# Altium project MBT03_IB_V2.PrjPcb
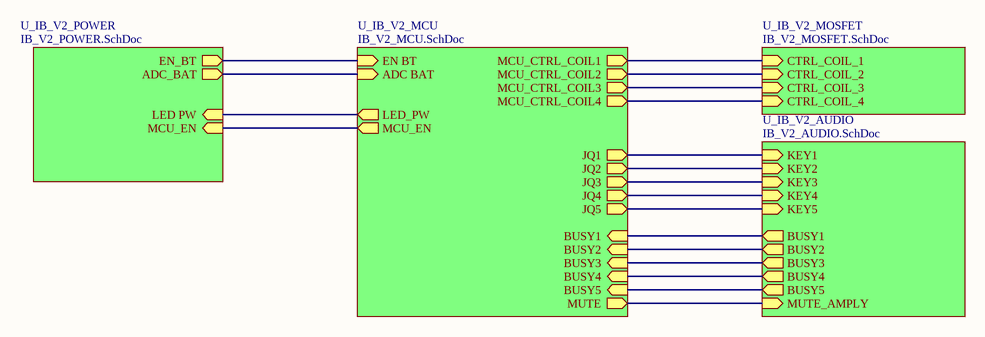
[diagram p0: IB_V2_OverView.SchDoc]
5 sheets, 129 parts. Net scope: hierarchical (ports join the sheet entries above them; power ports are global).
Board file: MBT03_IB_V2.PcbDoc
Sheets:
  IB_V2_OverView.SchDoc
    U_IB_V2_AUDIO = IB_V2_AUDIO.SchDoc
    U_IB_V2_MCU = IB_V2_MCU.SchDoc
    U_IB_V2_MOSFET = IB_V2_MOSFET.SchDoc
    U_IB_V2_POWER = IB_V2_POWER.SchDoc

## Sheet IB_V2_OverView.SchDoc
size A3; SheetNumber: 1; SheetTotal: 5

### Sub-sheets
U_IB_V2_AUDIO = IB_V2_AUDIO.SchDoc: KEY1 (in), KEY2 (in), KEY3 (in), KEY4 (in), KEY5 (in), BUSY1 (out), BUSY2 (out), BUSY3 (out), BUSY4 (out), BUSY5 (out), MUTE_AMPLY (in)
U_IB_V2_MCU = IB_V2_MCU.SchDoc: LED_PW (out), MCU_EN (out), EN BT (in), ADC BAT (in), MCU_CTRL_COIL1 (out), MCU_CTRL_COIL2 (out), BUSY1 (in), BUSY2 (in), BUSY3 (in), BUSY4 (in), BUSY5 (in), JQ1 (out), JQ2 (out), JQ3 (out), JQ4 (out), JQ5 (out), MUTE (out), MCU_CTRL_COIL3 (out), MCU_CTRL_COIL4 (out)
U_IB_V2_MOSFET = IB_V2_MOSFET.SchDoc: CTRL_COIL_1 (in), CTRL_COIL_2 (in), CTRL_COIL_3 (in), CTRL_COIL_4 (in)
U_IB_V2_POWER = IB_V2_POWER.SchDoc: EN_BT (out), ADC_BAT (out), MCU_EN (in), LED PW (in)

### Nets
NetC12_2: sheet U_IB_V2_MCU/ADC BAT, sheet U_IB_V2_POWER/ADC_BAT
NetD1_2: sheet U_IB_V2_MCU/EN BT, sheet U_IB_V2_POWER/EN_BT
NetH6_2: sheet U_IB_V2_AUDIO/MUTE_AMPLY, sheet U_IB_V2_MCU/MUTE
NetJQB1_1: sheet U_IB_V2_AUDIO/BUSY1, sheet U_IB_V2_MCU/BUSY1
NetJQB1_2: sheet U_IB_V2_AUDIO/KEY1, sheet U_IB_V2_MCU/JQ1
NetJQB1_4: sheet U_IB_V2_AUDIO/BUSY2, sheet U_IB_V2_MCU/BUSY2
NetJQB1_5: sheet U_IB_V2_AUDIO/KEY2, sheet U_IB_V2_MCU/JQ2
NetJQB1_7: sheet U_IB_V2_AUDIO/BUSY3, sheet U_IB_V2_MCU/BUSY3
NetJQB1_8: sheet U_IB_V2_AUDIO/KEY3, sheet U_IB_V2_MCU/JQ3
NetJQB1_10: sheet U_IB_V2_AUDIO/BUSY4, sheet U_IB_V2_MCU/BUSY4
NetJQB1_11: sheet U_IB_V2_AUDIO/KEY4, sheet U_IB_V2_MCU/JQ4
NetJQB1_13: sheet U_IB_V2_AUDIO/BUSY5, sheet U_IB_V2_MCU/BUSY5
NetJQB1_14: sheet U_IB_V2_AUDIO/KEY5, sheet U_IB_V2_MCU/JQ5
NetR20_2: sheet U_IB_V2_MCU/MCU_CTRL_COIL1, sheet U_IB_V2_MOSFET/CTRL_COIL_1
NetR25_2: sheet U_IB_V2_MCU/MCU_CTRL_COIL2, sheet U_IB_V2_MOSFET/CTRL_COIL_2
NetR30_2: sheet U_IB_V2_MCU/MCU_CTRL_COIL3, sheet U_IB_V2_MOSFET/CTRL_COIL_3
NetR35_2: sheet U_IB_V2_MCU/MCU_CTRL_COIL4, sheet U_IB_V2_MOSFET/CTRL_COIL_4
NetR47_2: sheet U_IB_V2_MCU/LED_PW, sheet U_IB_V2_POWER/LED PW
NetR48_1: sheet U_IB_V2_MCU/MCU_EN, sheet U_IB_V2_POWER/MCU_EN

## Sheet IB_V2_AUDIO.SchDoc
size A2; SheetNumber: 4; SheetTotal: 5
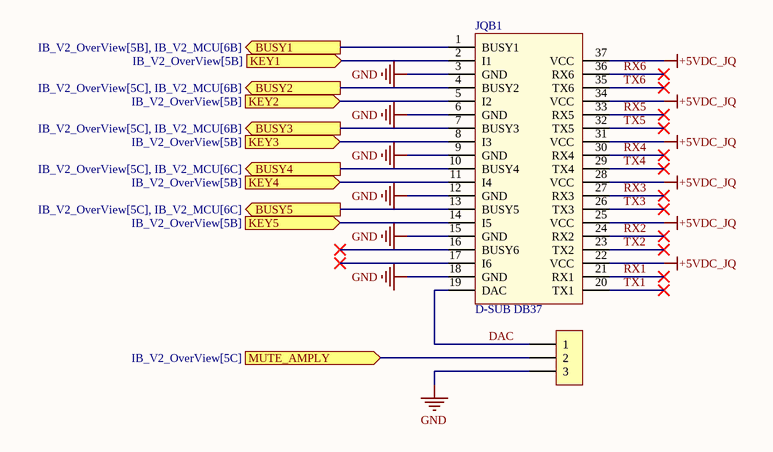
[diagram p1: IB_V2_AUDIO.SchDoc]

### Parts
H6  Header 3P 2.54 Duc Thang  [XH2.54M-3]  (value not drawn)
JQB1  D-SUB DB37  [JQ BOARD]

### Ports
BUSY1 (out, see IB_V2_OverView[5B], IB_V2_MCU[6B]), BUSY2 (out, see IB_V2_OverView[5C], IB_V2_MCU[6B]), BUSY3 (out, see IB_V2_OverView[5C], IB_V2_MCU[6B]), BUSY4 (out, see IB_V2_OverView[5C], IB_V2_MCU[6C]), BUSY5 (out, see IB_V2_OverView[5C], IB_V2_MCU[6C]), KEY1 (in, see IB_V2_OverView[5B]), KEY2 (in, see IB_V2_OverView[5B]), KEY3 (in, see IB_V2_OverView[5B]), KEY4 (in, see IB_V2_OverView[5B]), KEY5 (in, see IB_V2_OverView[5B]), MUTE_AMPLY (in, see IB_V2_OverView[5C])

### Nets
+5VDC_JQ: JQB1.22(VCC) JQB1.25(VCC) JQB1.28(VCC) JQB1.31(VCC) JQB1.34(VCC) JQB1.37(VCC)  [project net +5V]
GND: H6.3 JQB1.3(GND) JQB1.6(GND) JQB1.9(GND) JQB1.12(GND) JQB1.15(GND) JQB1.18(GND)
DAC: H6.1 JQB1.19(DAC)
RX1: JQB1.21(RX1)
RX2: JQB1.24(RX2)
RX3: JQB1.27(RX3)
RX4: JQB1.30(RX4)
RX5: JQB1.33(RX5)
RX6: JQB1.36(RX6)
TX1: JQB1.20(TX1)
TX2: JQB1.23(TX2)
TX3: JQB1.26(TX3)
TX4: JQB1.29(TX4)
TX5: JQB1.32(TX5)
TX6: JQB1.35(TX6)
NetH6_2: H6.2 ; port MUTE_AMPLY
NetJQB1_1: JQB1.1(BUSY1) ; port BUSY1
NetJQB1_2: JQB1.2(I1) ; port KEY1
NetJQB1_4: JQB1.4(BUSY2) ; port BUSY2
NetJQB1_5: JQB1.5(I2) ; port KEY2
NetJQB1_7: JQB1.7(BUSY3) ; port BUSY3
NetJQB1_8: JQB1.8(I3) ; port KEY3
NetJQB1_10: JQB1.10(BUSY4) ; port BUSY4
NetJQB1_11: JQB1.11(I4) ; port KEY4
NetJQB1_13: JQB1.13(BUSY5) ; port BUSY5
NetJQB1_14: JQB1.14(I5) ; port KEY5

Not connected (* = marked no-connect by the designer): JQB1 16(BUSY6)* 17(I6)*

### Library data of the parts
H6 = Header 3P 2.54 Duc Thang: Cắm; Ten_Linh_Kien: Header 3P XH2.54-3P Đực Thẳng; Don_Vi: Con; Ma_Hang: MH001292; Chung_Loai: Cắm
JQB1 = JQ8900: DB37-2.77 Cái Thẳng 2 Hàng chân hàn PCB

## Sheet IB_V2_MCU.SchDoc
size A2; SheetNumber: 2; SheetTotal: 5
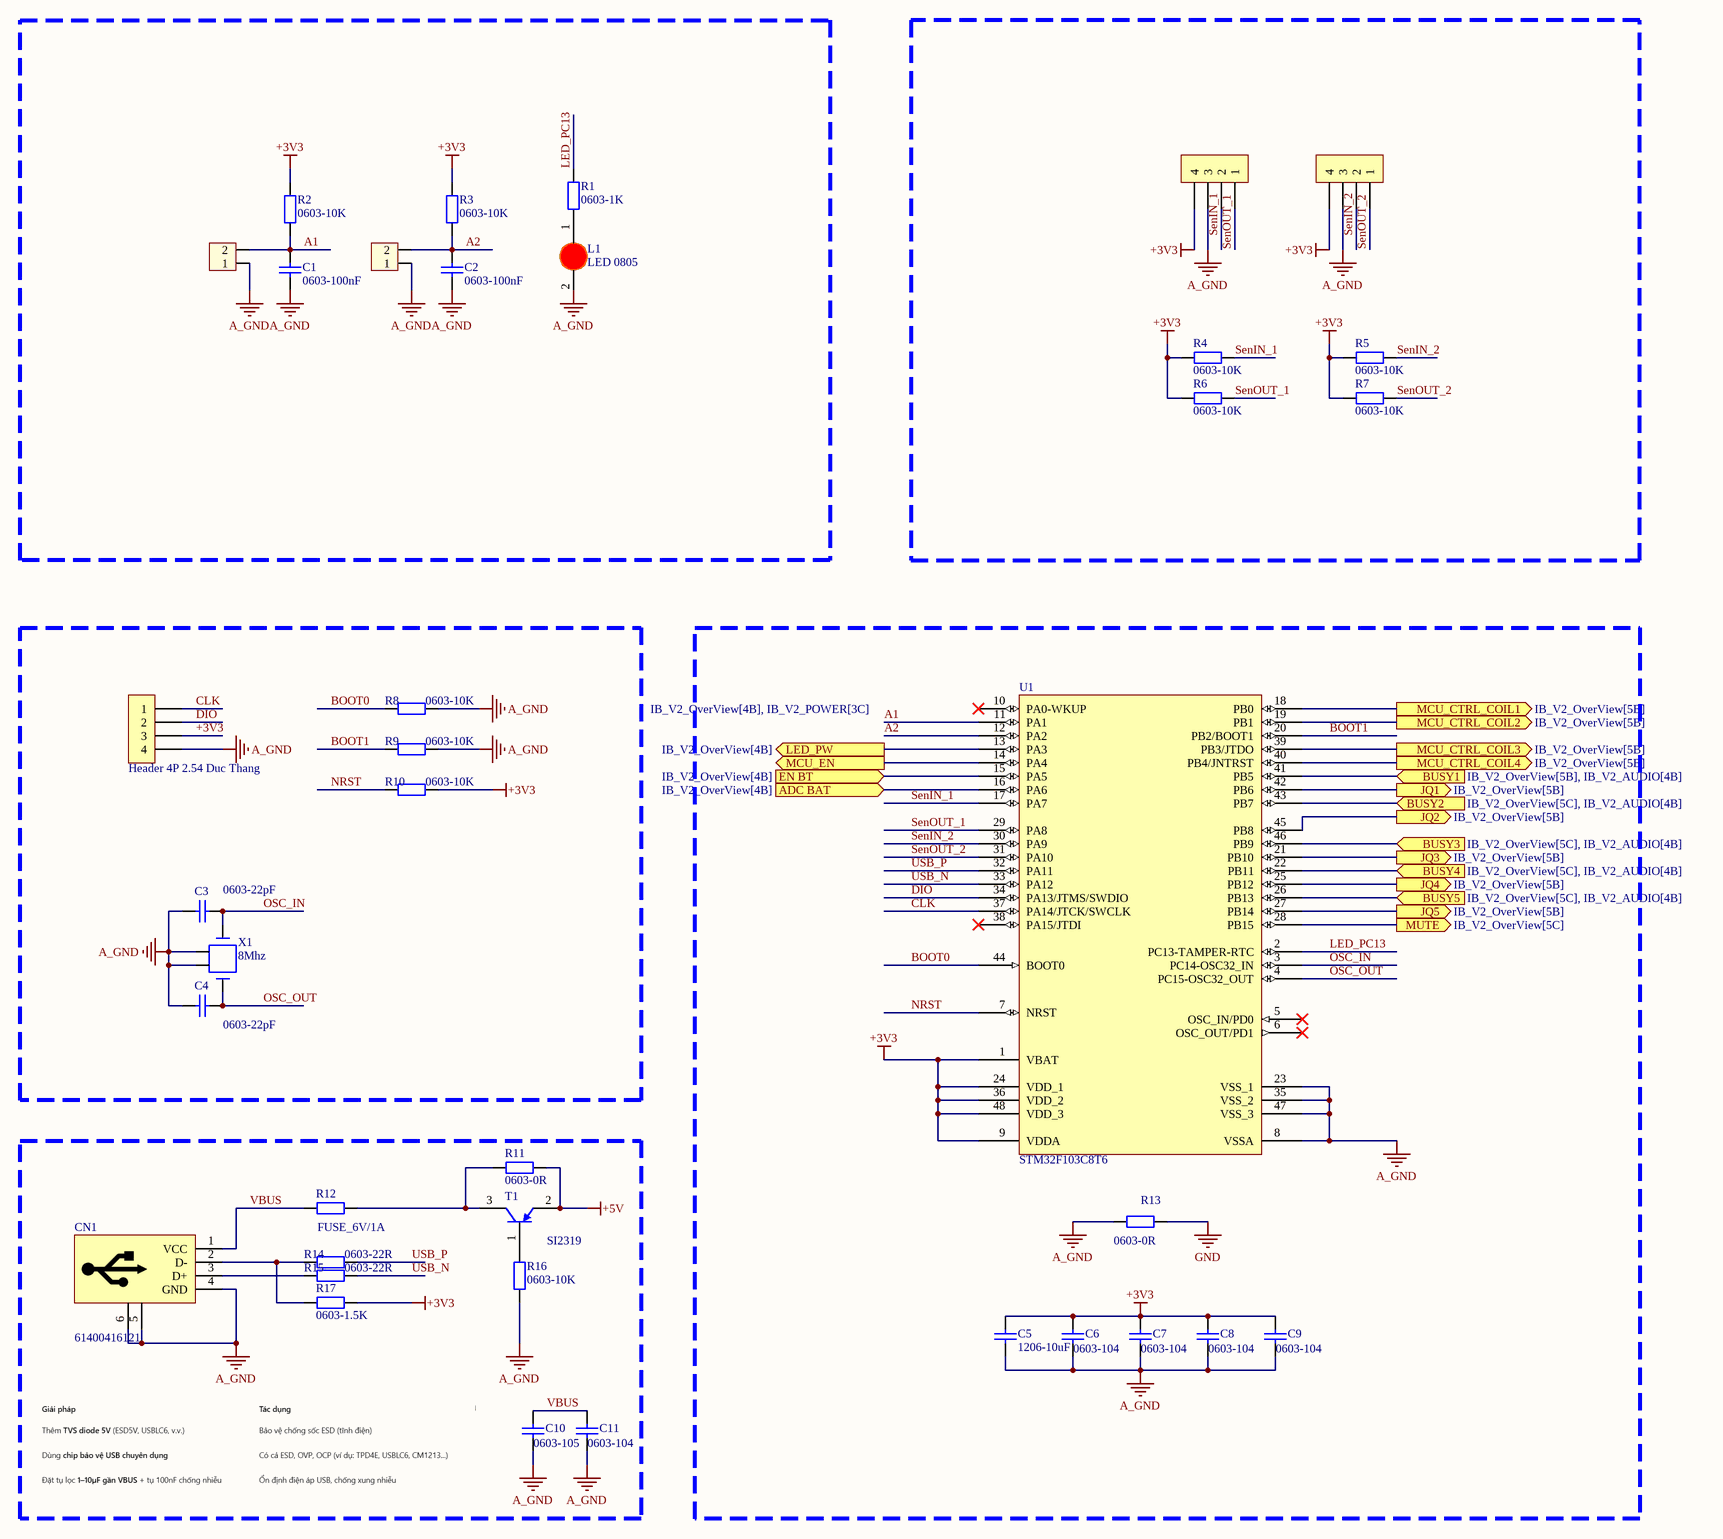
[diagram p2: IB_V2_MCU.SchDoc]

### Parts
C1  0603-100nF  [Cap 0603]
C2  0603-100nF  [Cap 0603]
C3  0603-22pF  [Cap 0603]
C4  0603-22pF  [Cap 0603]
C5  1206-10uF  [Cap 1206]
C6  0603-104  [Cap 0603]
C7  0603-104  [Cap 0603]
C8  0603-104  [Cap 0603]
C9  0603-104  [Cap 0603]
C10  0603-105  [Cap 0603]
C11  0603-104  [Cap 0603]
CN1  61400416121  [USB-B_61400416121]
H1  Header 4P 2.54 Duc Thang  [XH2.54M-4]  (value not drawn)
H2  Header 4P 2.54 Duc Thang  [XH2.54M-4]  (value not drawn)
H3  Header 2P 2.54 Duc Thang  [XH2.54M-2]  (value not drawn)
H4  Header 2P 2.54 Duc Thang  [XH2.54M-2]  (value not drawn)
H5  Header 4P 2.54 Duc Thang  [XH2.54M-4]
L1  LED 0805  [LED-0805-Red]
R1  0603-1K  [RES 0603]
R2  0603-10K  [RES 0603]
R3  0603-10K  [RES 0603]
R4  0603-10K  [RES 0603]
R5  0603-10K  [RES 0603]
R6  0603-10K  [RES 0603]
R7  0603-10K  [RES 0603]
R8  0603-10K  [RES 0603]
R9  0603-10K  [RES 0603]
R10  0603-10K  [RES 0603]
R11  0603-0R  [RES 0603]
R12  FUSE_6V/1A  [tro smd 1206]
R13  0603-0R  [RES 0603]
R14  0603-22R  [RES 0603]
R15  0603-22R  [RES 0603]
R16  0603-10K  [RES 0603]
R17  0603-1.5K  [RES 0603]
T1  SI2319  [SOT - 23]
U1  STM32F103C8T6  [LQFP48_L]
X1  8Mhz  [XTAL_SMD5032]

### Ports
ADC BAT (in, see IB_V2_OverView[4B]), BUSY1 (in, see IB_V2_OverView[5B], IB_V2_AUDIO[4B]), BUSY2 (in, see IB_V2_OverView[5C], IB_V2_AUDIO[4B]), BUSY3 (in, see IB_V2_OverView[5C], IB_V2_AUDIO[4B]), BUSY4 (in, see IB_V2_OverView[5C], IB_V2_AUDIO[4B]), BUSY5 (in, see IB_V2_OverView[5C], IB_V2_AUDIO[4B]), EN BT (in, see IB_V2_OverView[4B]), JQ1 (out, see IB_V2_OverView[5B]), JQ2 (out, see IB_V2_OverView[5B]), JQ3 (out, see IB_V2_OverView[5B]), JQ4 (out, see IB_V2_OverView[5B]), JQ5 (out, see IB_V2_OverView[5B]), LED_PW (out, see IB_V2_OverView[4B]), MCU_CTRL_COIL1 (out, see IB_V2_OverView[5B]), MCU_CTRL_COIL2 (out, see IB_V2_OverView[5B]), MCU_CTRL_COIL3 (out, see IB_V2_OverView[5B]), MCU_CTRL_COIL4 (out, see IB_V2_OverView[5B]), MCU_EN (out, see IB_V2_OverView[4B], IB_V2_POWER[3C]), MUTE (out, see IB_V2_OverView[5C])

### Nets
+3V3: C5.1 C6.1 C7.1 C8.1 C9.1 H1.4 H2.4 H5.3 R2.2 R3.2 R4.1 R5.1 R6.1 R7.1 R10.2 R17.1 U1.1(VBAT) U1.9(VDDA) U1.24(VDD_1) U1.36(VDD_2) U1.48(VDD_3)
+5V: R11.1 T1.2(E)
A_GND: C1.2 C2.2 C3.1 C4.1 C5.2 C6.2 C7.2 C8.2 C9.2 C10.2 C11.2 CN1.4(GND) CN1.5(GND) CN1.6(GND) H1.3 H2.3 H3.1 H4.1 H5.4 L1.2(K) R8.2 R9.2 R13.1 R16.2 U1.8(VSSA) U1.23(VSS_1) U1.35(VSS_2) U1.47(VSS_3) X1.2(GND) X1.4(GND)
GND: R13.2
A1: C1.1 H3.2 R2.1 U1.11(PA1)
A2: C2.1 H4.2 R3.1 U1.12(PA2)
BOOT0: R8.1 U1.44(BOOT0)
BOOT1: R9.1 U1.20(PB2/BOOT1)
CLK: H5.1 U1.37(PA14/JTCK/SWCLK)
DIO: H5.2 U1.34(PA13/JTMS/SWDIO)
LED_PC13: R1.2 U1.2(PC13-TAMPER-RTC)
NRST: R10.1 U1.7(NRST)
OSC_IN: C3.2 U1.3(PC14-OSC32_IN) X1.1(OSC1)
OSC_OUT: C4.2 U1.4(PC15-OSC32_OUT) X1.3(OSC2)
SenIN_1: H1.2 R4.2 U1.17(PA7)
SenIN_2: H2.2 R5.2 U1.30(PA9)
SenOUT_1: H1.1 R6.2 U1.29(PA8)
SenOUT_2: H2.1 R7.2 U1.31(PA10)
USB_N: R15.2 U1.33(PA12)
USB_P: R14.2 U1.32(PA11)
VBUS: C10.1 C11.1 CN1.1(VCC) R12.1
NetC12_2: U1.16(PA6) ; port ADC BAT
NetCN1_2: CN1.2(D-) R14.1 R17.2
NetCN1_3: CN1.3(D+) R15.1
NetD1_2: U1.15(PA5) ; port EN BT
NetH6_2: U1.28(PB15) ; port MUTE
NetJQB1_1: U1.41(PB5) ; port BUSY1
NetJQB1_2: U1.42(PB6) ; port JQ1
NetJQB1_4: U1.43(PB7) ; port BUSY2
NetJQB1_5: U1.45(PB8) ; port JQ2
NetJQB1_7: U1.46(PB9) ; port BUSY3
NetJQB1_8: U1.21(PB10) ; port JQ3
NetJQB1_10: U1.22(PB11) ; port BUSY4
NetJQB1_11: U1.25(PB12) ; port JQ4
NetJQB1_13: U1.26(PB13) ; port BUSY5
NetJQB1_14: U1.27(PB14) ; port JQ5
NetL1_1: L1.1(A) R1.1
NetR11_2: R11.2 R12.2 T1.3(C)
NetR16_1: R16.1 T1.1(B)
NetR20_2: U1.18(PB0) ; port MCU_CTRL_COIL1
NetR25_2: U1.19(PB1) ; port MCU_CTRL_COIL2
NetR30_2: U1.39(PB3/JTDO) ; port MCU_CTRL_COIL3
NetR35_2: U1.40(PB4/JNTRST) ; port MCU_CTRL_COIL4
NetR47_2: U1.13(PA3) ; port LED_PW
NetR48_1: U1.14(PA4) ; port MCU_EN

Not connected (* = marked no-connect by the designer): U1 5(OSC_IN/PD0)* 6(OSC_OUT/PD1)* 10(PA0-WKUP)* 38(PA15/JTDI)*

### Library data of the parts
C1 C2 C6-C11 = Cap 0603 100nF: 50V 100nF X7R ±5% 0603 Multilayer Ceramic Capacitors MLCC - SMD/SMT ROHS; ComponentLink1Description: LCSC ref link; ComponentLink1URL: https://www.lcsc.com/product-detail/Multilayer-Ceramic-Capacitors-MLCC-SMD-SMT_YAGEO-CC0603JRX7R9BB104_C91183.html?s_z=n_100nF%25200603%2520cap%252050v; Package: 0603
C3 C4 = Cap 0603 22pF: 50V 22pF C0G ±5% 0603 Multilayer Ceramic Capacitors MLCC - SMD/SMT ROHS; ComponentLink1Description: LCSC ref link; ComponentLink1URL: https://www.lcsc.com/product-detail/Multilayer-Ceramic-Capacitors-MLCC-SMD-SMT_Samsung-Electro-Mechanics-CL10C220JB8NNNC_C1653.html?s_z=n_22pF%25200603%2520cap%252050v; Package: 0603
C5 = Cap 1206 10uF: 50V 10uF X5R ±10% 1206 Multilayer Ceramic Capacitors MLCC - SMD/SMT ROHS; Package: 1206; ComponentLink1Description: LCSC ref link; ComponentLink1URL: https://www.lcsc.com/product-detail/Multilayer-Ceramic-Capacitors-MLCC-SMD-SMT_Samsung-Electro-Mechanics-CL31A106KBHNNNE_C13585.html?s_z=n_10uF%25201206%2520cap%252050v
CN1 = USB_61400416121: CONN COM TYPE B USB HORZ 4POS; Manufacturer: Wurth Electronics Inc.; Connector Type: USB - B; Number of Contacts: 4; Gender: Receptacle; Specifications: USB 2.0; Current Rating: 1.5A; Voltage - Rated: 30V; Mating Cycles: 1500; Shielding: Shielded; Material Flammability Rating: UL94 V-0; Supplier 1: Digi-Key; Manufacturer Part Number: 61400416121; RoHS: RoHS Compliant; Category: Connectors, Interconnects; Stock 1: 3084; Pricing 1: 1=1.32, 10=1.165, 50=1.098, 100=0.986, 250=0.896 (USD); Packaging: Tray; Part Status: Active; Mounting Type: Through Hole, Right Angle; Mounting Feature: Horizontal; Termination: Solder; Features: Board Lock; Ingress Protection: -; Operating Temperature: -40°C ~ 105°C; Contact Finish: Gold; Shell/Shielding Material: Brass; Insulation Color: White; ComponentLink1URL: http://katalog.we-online.de/em/datasheet/61400416121.pdf; ComponentLink1Description: http://katalog.we-online.de/em/datasheet/61400416121.pdf; Supplier Part Number 1: 732-2108-ND
H1 H2 H5 = Header 4P 2.54 Duc Thang: Cắm; Ten_Linh_Kien: Header 4P XH2.54-4P Đực Thẳng; Don_Vi: Con; Ma_Hang: MH001285; Chung_Loai: Cắm
H3 H4 = Header 2P 2.54 Duc Thang: Cắm; Ten_Linh_Kien: Header 2P XH2.54-2P Đực Thẳng; Don_Vi: Con; Ma_Hang: MH001283; Chung_Loai: Cắm
L1 = LED 0805 Do: Dán; Don_Vi: Con; Ma_Hang: MH000897; Ten_Linh_Kien: LED 0805 Màu Đỏ (Red); Ghi_Chu: *; Kieu_Chan: *; Chung_Loai: Dán
R1-R7 = Res 0603 10K: 0.1W Thick Film Resistors 75V ±100ppm/℃ ±1% 10kΩ 0603 Chip Resistor - Surface Mount ROHS; ComponentLink1Description: LCSC ref link; ComponentLink1URL: https://www.lcsc.com/product-detail/Chip-Resistor-Surface-Mount_UNI-ROYAL-Uniroyal-Elec-0603WAF1002T5E_C25804.html?s_z=s_Resistors%257CChip%2520Resistor%2520-%2520Surface%2520Mount; Package: 0603
R8-R11 R13-R17 = Res 0603 22R: 100mW Thick Film Resistors 75V ±100ppm/℃ ±1% 22Ω 0603 Chip Resistor - Surface Mount ROHS; Package: 0603; ComponentLink1Description: LCSC ref link; ComponentLink1URL: https://www.lcsc.com/product-detail/Chip-Resistor-Surface-Mount_YAGEO-RC0603FR-0722RL_C107701.html?s_z=n_res%25200603%252022r
R12 = Tro 1206 1% 1M: Dán; Don_Vi: Con; So_Chan: 2; Ten_Linh_Kien: Trở 1206 1% 1M; Ma_Hang: MH005881; Chung_Loai: Dán; Kieu_Chan: *
T1 = Transistor - A1015: P-Channel 40-V(D-S) MOSEFET / SOT-23/3 LEAD
U1 = STM32F103C8T6: IC MCU 32BIT 64KB FLASH 48LQFP; Manufacturer: STMicroelectronics; Core Processor: ARM® Cortex®-M3; Core Size: 32-Bit; Speed: 72MHz; Connectivity: CAN, I²C, IrDA, LIN, SPI, UART/USART, USB; Peripherals: DMA, Motor Control PWM, PDR, POR, PVD, PWM, Temp Sensor, WDT; Program Memory Size: 64KB (64K x 8); RAM Size: 20K x 8; Voltage - Supply (Vcc/Vdd): 2 V ~ 3.6 V; Data Converters: A/D 10x12b; Oscillator Type: Internal; Supplier 1: Digi-Key; Manufacturer Part Number: STM32F103C8T6; RoHS: RoHS Compliant; Category: Integrated Circuits (ICs); Stock 1: 3588; Pricing 1: 1=6.06, 10=5.438, 100=4.4558, 500=3.7931, 1000=3.199 (USD); Packaging: Tray; Part Status: Active; Program Memory Type: FLASH; EEPROM Size: -; Operating Temperature: -40°C ~ 85°C (TA); Package / Case: 48-LQFP; Base Part Number: STM32F103; ComponentLink1URL: https://media.digikey.com/pdf/Data%20Sheets/ST%20Microelectronics%20PDFS/STM32F103x8,B.pdf; ComponentLink1Description: https://media.digikey.com/pdf/Data%20Sheets/ST%20Microelectronics%20PDFS/STM32F103x8,B.pdf; Supplier Part Number 1: 497-6063-ND
X1 = XTAL_7B-8.000MAAJ-T: CRYSTAL 8.0000MHZ 18PF SMD; Manufacturer 1: TXC CORPORATION; Category 1: Crystals, Oscillators, Resonators; Frequency Stability: ±30ppm; ESR (Equivalent Series Resistance): 100 Ohm; Operating Mode: Fundamental; Supplier 1: Digi-Key; Supplier Part Number 1: 887-1452-1-ND; Manufacturer Part Number 1: 7B-8.000MAAJ-T; RoHS 1: RoHS Compliant; Description 1: CRYSTAL 8.0000MHZ 18PF SMD; Stock 1: 21080; Pricing 1: 1=0.86, 10=0.759, 50=0.7096, 100=0.627, 500=0.594 (USD); Packaging: Cut Tape (CT); Part Status: Active; Type: MHz Crystal; Frequency: 8MHz; Frequency Tolerance: ±30ppm; Load Capacitance: 18pF; Operating Temperature: -20°C ~ 70°C; Ratings: -; Mounting Type: Surface Mount; Package / Case: 4-SMD, No Lead; Size / Dimension: 0.197" L x 0.126" W (5.00mm x 3.20mm); Height - Seated (Max): 0.041" (1.05mm); ComponentLink1URL: http://www.txccorp.com/download/products/quartz_crystals/2015TXC_7B_19.pdf; ComponentLink1Description: http://www.txccorp.com/download/products/quartz_crystals/2015TXC_7B_19.pdf

## Sheet IB_V2_MOSFET.SchDoc
size A3; SheetNumber: 3; SheetTotal: 5
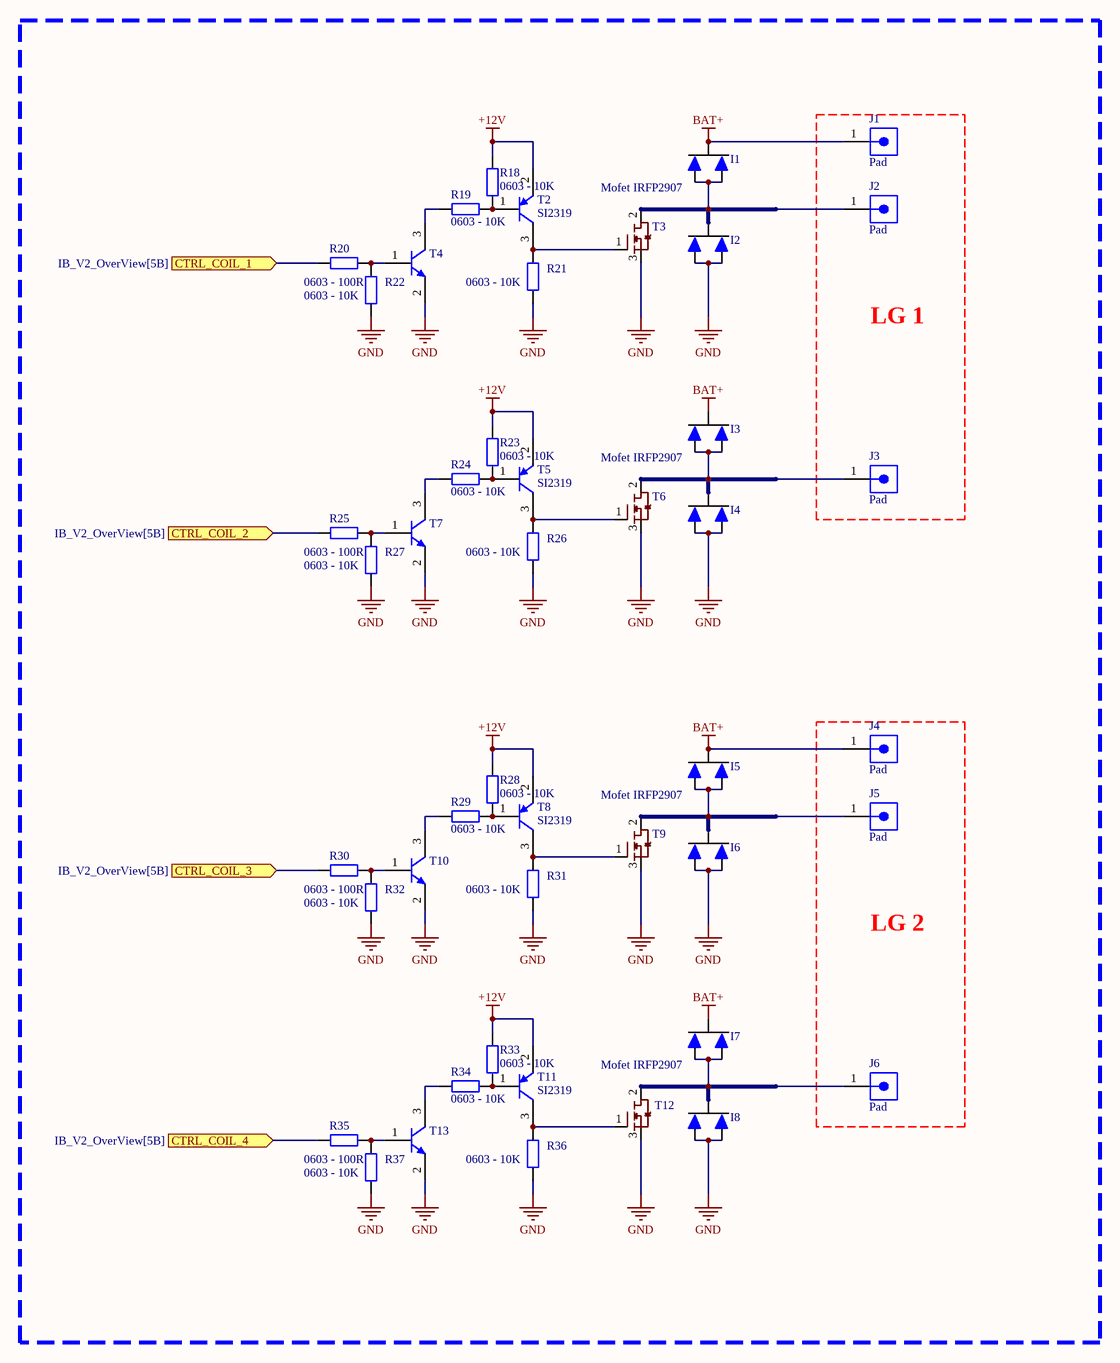
[diagram p3: IB_V2_MOSFET.SchDoc]

### Parts
I1  12CWQ10FN  [TO-252]  (value not drawn)
I2  12CWQ10FN  [TO-252]  (value not drawn)
I3  12CWQ10FN  [TO-252]  (value not drawn)
I4  12CWQ10FN  [TO-252]  (value not drawn)
I5  12CWQ10FN  [TO-252]  (value not drawn)
I6  12CWQ10FN  [TO-252]  (value not drawn)
I7  12CWQ10FN  [TO-252]  (value not drawn)
I8  12CWQ10FN  [TO-252]  (value not drawn)
J1  Pad  [pad_4.5x4.5_hole_2.5mm]
J2  Pad  [pad_4.5x4.5_hole_2.5mm]
J3  Pad  [pad_4.5x4.5_hole_2.5mm]
J4  Pad  [pad_4.5x4.5_hole_2.5mm]
J5  Pad  [pad_4.5x4.5_hole_2.5mm]
J6  Pad  [pad_4.5x4.5_hole_2.5mm]
R18  0603 - 10K  [tro smd 0603]
R19  0603 - 10K  [tro smd 0603]
R20  0603 - 100R  [tro smd 0603]
R21  0603 - 10K  [tro smd 0603]
R22  0603 - 10K  [tro smd 0603]
R23  0603 - 10K  [tro smd 0603]
R24  0603 - 10K  [tro smd 0603]
R25  0603 - 100R  [tro smd 0603]
R26  0603 - 10K  [tro smd 0603]
R27  0603 - 10K  [tro smd 0603]
R28  0603 - 10K  [tro smd 0603]
R29  0603 - 10K  [tro smd 0603]
R30  0603 - 100R  [tro smd 0603]
R31  0603 - 10K  [tro smd 0603]
R32  0603 - 10K  [tro smd 0603]
R33  0603 - 10K  [tro smd 0603]
R34  0603 - 10K  [tro smd 0603]
R35  0603 - 100R  [tro smd 0603]
R36  0603 - 10K  [tro smd 0603]
R37  0603 - 10K  [tro smd 0603]
T2  SI2319  [SOT - 23]
T3  Mofet IRFP2907  [TO 247 AC]
T4  MMBT2222A 1P Transistor NPN  [SOT - 23]  (value not drawn)
T5  SI2319  [SOT - 23]
T6  Mofet IRFP2907  [TO 247 AC]
T7  MMBT2222A 1P Transistor NPN  [SOT - 23]  (value not drawn)
T8  SI2319  [SOT - 23]
T9  Mofet IRFP2907  [TO 247 AC]
T10  MMBT2222A 1P Transistor NPN  [SOT - 23]  (value not drawn)
T11  SI2319  [SOT - 23]
T12  Mofet IRFP2907  [TO 247 AC]
T13  MMBT2222A 1P Transistor NPN  [SOT - 23]  (value not drawn)

### Blocks framed on the sheet
LG 1: J1-J3
LG 2: J4-J6

### Ports
CTRL_COIL_1 (in, see IB_V2_OverView[5B]), CTRL_COIL_2 (in, see IB_V2_OverView[5B]), CTRL_COIL_3 (in, see IB_V2_OverView[5B]), CTRL_COIL_4 (in, see IB_V2_OverView[5B])

### Nets
+12V: R18.1 R23.1 R28.1 R33.1 T2.2(E) T5.2(E) T8.2(E) T11.2(E)
BAT+: I1.2(Ktot) I3.2(Ktot) I5.2(Ktot) I7.2(Ktot) J1.1 J4.1
GND: I2.1(Anot) I2.3(Anot) I4.1(Anot) I4.3(Anot) I6.1(Anot) I6.3(Anot) I8.1(Anot) I8.3(Anot) R21.1 R22.1 R26.1 R27.1 R31.1 R32.1 R36.1 R37.1 T3.3(S) T4.2(E) T6.3(S) T7.2(E) T9.3(S) T10.2(E) T12.3(S) T13.2(E)
NetI1_1: I1.1(Anot) I1.3(Anot) I2.2(Ktot) J2.1 T3.2(D)
NetI3_1: I3.1(Anot) I3.3(Anot) I4.2(Ktot) J3.1 T6.2(D)
NetI5_1: I5.1(Anot) I5.3(Anot) I6.2(Ktot) J5.1 T9.2(D)
NetI7_1: I7.1(Anot) I7.3(Anot) I8.2(Ktot) J6.1 T12.2(D)
NetR18_2: R18.2 R19.1 T2.1(B)
NetR19_2: R19.2 T4.3(C)
NetR20_1: R20.1 R22.2 T4.1(B)
NetR20_2: R20.2 ; port CTRL_COIL_1
NetR21_2: R21.2 T2.3(C) T3.1(G)
NetR23_2: R23.2 R24.1 T5.1(B)
NetR24_2: R24.2 T7.3(C)
NetR25_1: R25.1 R27.2 T7.1(B)
NetR25_2: R25.2 ; port CTRL_COIL_2
NetR26_2: R26.2 T5.3(C) T6.1(G)
NetR28_2: R28.2 R29.1 T8.1(B)
NetR29_2: R29.2 T10.3(C)
NetR30_1: R30.1 R32.2 T10.1(B)
NetR30_2: R30.2 ; port CTRL_COIL_3
NetR31_2: R31.2 T8.3(C) T9.1(G)
NetR33_2: R33.2 R34.1 T11.1(B)
NetR34_2: R34.2 T13.3(C)
NetR35_1: R35.1 R37.2 T13.1(B)
NetR35_2: R35.2 ; port CTRL_COIL_4
NetR36_2: R36.2 T11.3(C) T12.1(G)

### Library data of the parts
I1-I8 = Diode - 12CWQ10FN: Diode Schottky 100V 12A, SMD DPAK
J1-J6 = Pad: Ports: 1; Positions/Loaded: Port1 - 4/2; PerformanceCategory: 3; PCB_Mounting: Thru-Hole; PCB_Thickness: 0.125"; DrillSize: Nominal, Rounded to nearest 0.05mm; PCB_Layout: Complies with Manufacturer's Recommendation.; Published: 25-Jun-2002; DatasheetDocument: 20-Nov-2001; PackageDocument: 20-Nov-2001; PackageReference: 42878-4410; Publisher: Altium Limited; ComponentLink1Description: Manufacturer Link; ComponentLink1URL: http://www.molex.com/; ComponentLink2Description: Datasheet; ComponentLink2URL: http://www.molex.com/cmc_upload/common_files/1212003_42878catalogpage.pdf
R18-R37 = Tro 0603 1% 680R: Dán; Don_Vi: Con; So_Chan: 2; Ten_Linh_Kien: Trở 0603 1% 680R; Ma_Hang: MH006336; Chung_Loai: Dán; Kieu_Chan: *
T2 T5 T8 T11 = Transistor - A1015: as T1 on sheet IB_V2_MCU
T3 T6 T9 T12 = IRFP2907
T4 T7 T10 T13 = Transistor - 2N2222: Transistor NPN 40V 0.6A 3 Chân SOT-23/3 LEAD

## Sheet IB_V2_POWER.SchDoc
size A2; SheetNumber: 5; SheetTotal: 5
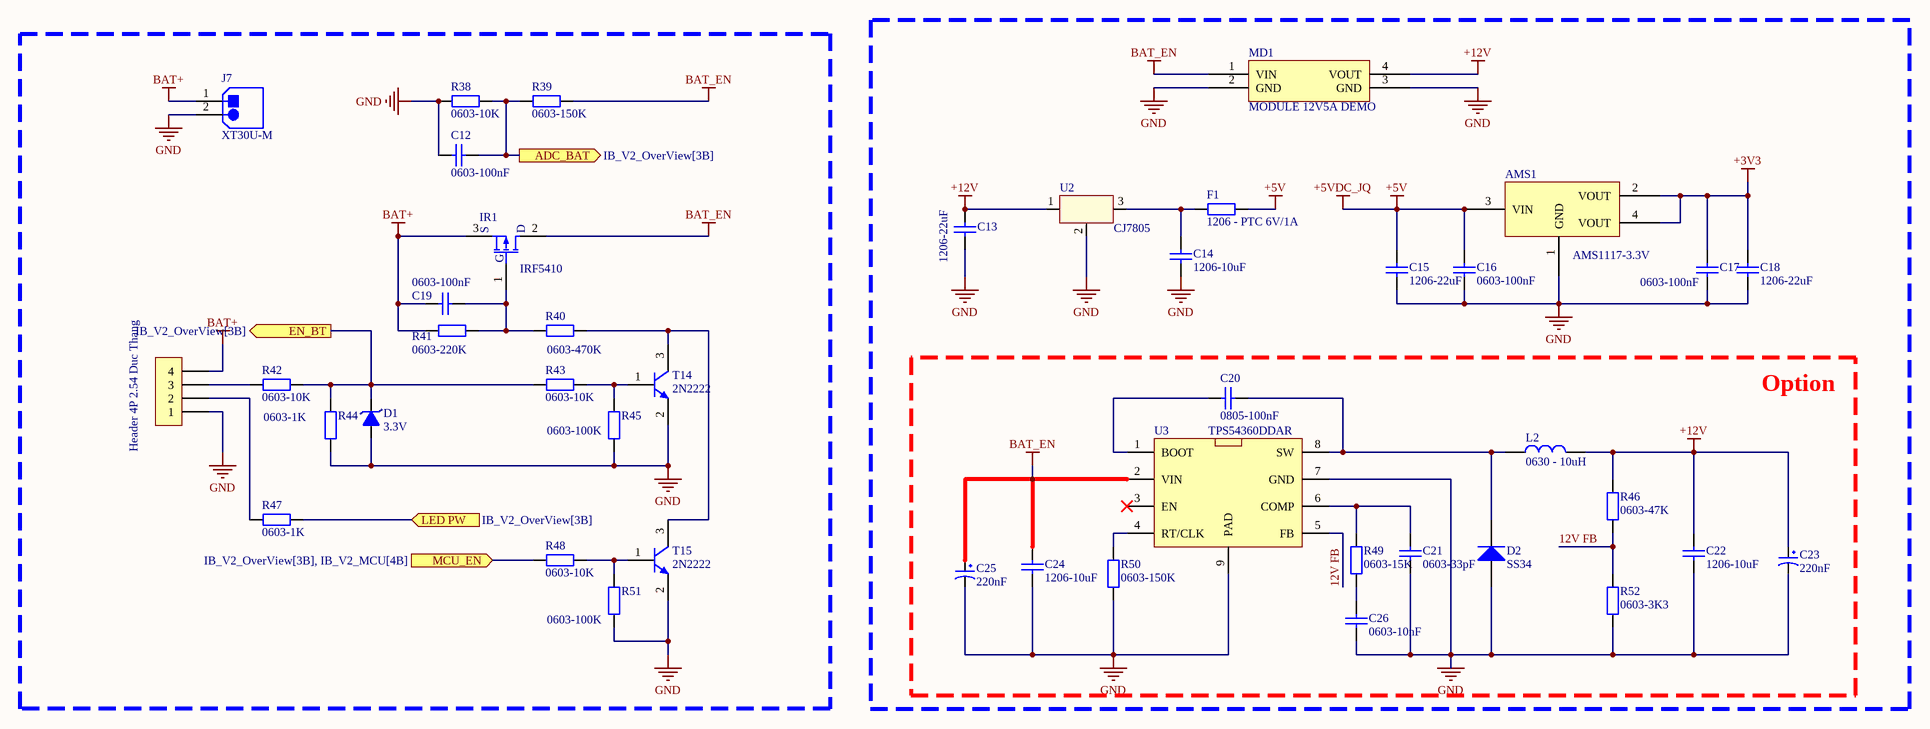
[diagram p4: IB_V2_POWER.SchDoc]

### Parts
AMS1  AMS1117-3.3V  [SOT223]
C12  0603-100nF  [Cap 0603]
C13  1206-22uF  [Cap 1206]
C14  1206-10uF  [Cap 1206]
C15  1206-22uF  [Cap 1206]
C16  0603-100nF  [Cap 0603]
C17  0603-100nF  [Cap 0603]
C18  1206-22uF  [Cap 1206]
C19  0603-100nF  [Cap 0603]
C20  0805-100nF  [Cap 0805]
C21  0603-33pF  [Cap 0603]
C22  1206-10uF  [Cap 1206]
C23  220nF  [tu hoa 8mm]
C24  1206-10uF  [Cap 1206]
C25  220nF  [tu hoa 8mm]
C26  0603-10nF  [Cap 0603]
D1  3.3V  [DIODE ZENNER SMD SOD80]
D2  SS34  [DIODE SMA]
F1  1206 - PTC 6V/1A  [tro smd 1206]
H7  Header 4P 2.54 Duc Thang  [XH2.54M-4]
IR1  IRF5410  [TO-252]
J7  XT30U-M  [XT30U]
L2  0630 - 10uH  [0630_Inductor]
MD1  MODULE 12V5A DEMO  [MODULE 12V5A]
R38  0603-10K  [RES 0603]
R39  0603-150K  [RES 0603]
R40  0603-470K  [RES 0603]
R41  0603-220K  [RES 0603]
R42  0603-10K  [RES 0603]
R43  0603-10K  [RES 0603]
R44  0603-1K  [RES 0603]
R45  0603-100K  [RES 0603]
R46  0603-47K  [RES 0603]
R47  0603-1K  [RES 0603]
R48  0603-10K  [RES 0603]
R49  0603-15K  [RES 0603]
R50  0603-150K  [RES 0603]
R51  0603-100K  [RES 0603]
R52  0603-3K3  [RES 0603]
T14  2N2222  [SOT - 23]
T15  2N2222  [SOT - 23]
U2  CJ7805  [To263 2L]
U3  TPS54360DDAR  [SOIC-8-EP]

### Blocks framed on the sheet
Option: C20-C26 D2 L2 R46 R49 R50 R52 U3

### Ports
ADC_BAT (out, see IB_V2_OverView[3B]), EN_BT (out, see IB_V2_OverView[3B]), LED PW (in, see IB_V2_OverView[3B]), MCU_EN (in, see IB_V2_OverView[3B], IB_V2_MCU[4B])

### Nets
+3V3: AMS1.2(VOUT) AMS1.4(VOUT) C17.1 C18.1
+5V: AMS1.3(VIN) C15.1 C16.1 F1.2  [also labelled +5VDC_JQ]
+12V: C13.1 C22.1 C23.1 L2.2 MD1.4(VOUT) R46.2 U2.1(Vin)
BAT+: C19.1 H7.4 IR1.3(S) J7.1 R41.1
BAT_EN: C24.1 C25.1 IR1.2(D) MD1.1(VIN) R39.1 U3.2(VIN)
GND: AMS1.1(GND) C12.1 C13.2 C14.2 C15.2 C16.2 C17.2 C18.2 C21.2 C22.2 C23.2 C24.2 C25.2 C26.2 D1.1(A) D2.1(A) H7.1 J7.2 MD1.2(GND) MD1.3(GND) R38.2 R44.1 R45.1 R50.1 R51.1 R52.1 T14.2(E) T15.2(E) U2.2(GND) U3.7(GND) U3.9(PAD)
12V FB: R46.1 R52.2 U3.5(FB)
NetC12_2: C12.2 R38.1 R39.2 ; port ADC_BAT
NetC14_1: C14.1 F1.1 U2.3(Vout)
NetC19_2: C19.2 IR1.1(G) R40.1 R41.2
NetC20_1: C20.1 D2.2(K) L2.1 U3.8(SW)
NetC20_2: C20.2 U3.1(BOOT)
NetC21_1: C21.1 R49.2 U3.6(COMP)
NetC26_1: C26.1 R49.1
NetD1_2: D1.2(K) R42.2 R43.1 R44.2 ; port EN_BT
NetH7_2: H7.2 R47.1
NetH7_3: H7.3 R42.1
NetR40_2: R40.2 T14.3(C) T15.3(C)
NetR43_2: R43.2 R45.2 T14.1(B)
NetR47_2: R47.2 ; port LED PW
NetR48_1: R48.1 ; port MCU_EN
NetR48_2: R48.2 R51.2 T15.1(B)
NetR50_2: R50.2 U3.4(RT/CLK)

Not connected (* = marked no-connect by the designer): U3 3(EN)*

### Library data of the parts
AMS1 = AMS1117 SMD: Dán; Value: AMS1117-3.3V SOT223; Don_Vi: Con; Ma_Hang: MH000596; Ghi_Chu: *; Kieu_Chan: *; Chung_Loai: Dán
C12 C16 C17 C19 = Cap 0603 100nF: as C1 on sheet IB_V2_MCU; ComponentLink1Description: LCSC ref link; ComponentLink1URL: https://www.lcsc.com/product-detail/Multilayer-Ceramic-Capacitors-MLCC-SMD-SMT_YAGEO-CC0603JRX7R9BB104_C91183.html?s_z=n_100nF%25200603%2520cap%252050v; Package: 0603
C13 C15 C18 = Cap 1206 22uF: 25V 22uF X5R ±10% 1206 Multilayer Ceramic Capacitors MLCC - SMD/SMT ROHS; ComponentLink1Description: LCSC ref link; ComponentLink1URL: https://www.lcsc.com/product-detail/Multilayer-Ceramic-Capacitors-MLCC-SMD-SMT_Samsung-Electro-Mechanics-CL31A226KAHNNNE_C12891.html?s_z=n_22uF%25201206%2520cap%252050v; Package: 1206
C14 C22 C24 = Cap 1206 10uF: as C5 on sheet IB_V2_MCU; Package: 1206; ComponentLink1Description: LCSC ref link; ComponentLink1URL: https://www.lcsc.com/product-detail/Multilayer-Ceramic-Capacitors-MLCC-SMD-SMT_Samsung-Electro-Mechanics-CL31A106KBHNNNE_C13585.html?s_z=n_10uF%25201206%2520cap%252050v
C20 = Cap 0805 100nF: 50V 100nF X7R ±10% 0805 Multilayer Ceramic Capacitors MLCC - SMD/SMT ROHS; Package: 0805; ComponentLink1Description: LCSC ref link; ComponentLink1URL: https://www.lcsc.com/product-detail/Multilayer-Ceramic-Capacitors-MLCC-SMD-SMT_YAGEO-CC0805KRX7R9BB104_C49678.html?s_z=n_100nF%25200805%2520cap%252050v
C21 = Cap 0603 33pF: 50V 33pF C0G ±5% 0603 Multilayer Ceramic Capacitors MLCC - SMD/SMT ROHS; ComponentLink1Description: LCSC ref link; ComponentLink1URL: https://www.lcsc.com/product-detail/Multilayer-Ceramic-Capacitors-MLCC-SMD-SMT_Samsung-Electro-Mechanics-CL10C330JB8NNNC_C1663.html?s_z=n_33pF%25200603%2520cap%252050v; Package: 0603
C23 C25 = Tu Hoa 220uF 35V 8x12: Cắm; Don_Vi: Con; So_Chan: 2; Ten_Linh_Kien: Tụ Hóa 220uF 35V 8x12MM; Ma_Hang: MH006553; Chung_Loai: Cắm; Kieu_Chan: *
C26 = Cap 0603 100nF: 50V 10nF X7R ±5% 0603 Multilayer Ceramic Capacitors MLCC - SMD/SMT ROHS; ComponentLink1Description: LCSC ref link; ComponentLink1URL: https://www.lcsc.com/product-detail/Multilayer-Ceramic-Capacitors-MLCC-SMD-SMT_YAGEO-CC0603JRX7R9BB104_C91183.html?s_z=n_100nF%25200603%2520cap%252050v; Package: 0603
D1 = Diode Zener 3.3V: Dán; Don_Vi: Con; Ma_Hang: MH002880; Ten_Linh_Kien: Diode Zener 1/2W 3.3V SMD1206 ZMM3.3; Kieu_Chan: *; Ghi_Chu: *; Chung_Loai: Dán
D2 = Diode SS34 ( 1N5822 ): Dán; Don_Vi: Con; Ma_Hang: MH002104; Ten_Linh_Kien: Diode SS34 3A 40V SMA ( 1N5822 SS34A); Kieu_Chan: *; Chung_Loai: Dán
F1 = Tro 1206 1% 10R: Dán; Don_Vi: Con; So_Chan: 2; Ten_Linh_Kien: Trở 1206 1% 10R; Ma_Hang: MH005886; Chung_Loai: Dán; Kieu_Chan: *
H7 = Header 4P 2.54 Duc Thang: as H1 on sheet IB_V2_MCU; Chung_Loai: Cắm
IR1 = Mosfet - DTU40P06
J7 = XT30U-M: Socket; DC supply; XT30; male; PIN: 2; on PCBs; THT; Colour: yellow
L2 = 0630_Inductor
R38 R46 = Res 0603 47K: 100mW Thick Film Resistors 75V ±100ppm/℃ ±1% 47kΩ 0603 Chip Resistor - Surface Mount ROHS; ComponentLink1Description: LCSC ref link; ComponentLink1URL: https://www.lcsc.com/product-detail/Chip-Resistor-Surface-Mount_YAGEO-RC0603FR-0747KL_C105579.html?s_z=n_47k%25200603%2520res; Package: 0603
R39 = Res 0603 820K: 100mW Thick Film Resistors 75V ±100ppm/℃ ±1% 820kΩ 0603 Chip Resistor - Surface Mount ROHS; Package: 0603; ComponentLink1Description: LCSC ref link; ComponentLink1URL: https://www.lcsc.com/product-detail/Chip-Resistor-Surface-Mount_YAGEO-RC0603FR-07820KL_C141684.html?s_z=n_820k%25200603%2520res
R40 = Res 0603 470K: 100mW Thick Film Resistors 75V ±100ppm/℃ ±1% 470kΩ 0603 Chip Resistor - Surface Mount ROHS; ComponentLink1Description: LCSC ref link; ComponentLink1URL: https://www.lcsc.com/product-detail/Chip-Resistor-Surface-Mount_YAGEO-RC0603FR-07470KL_C114622.html?s_z=n_470k%25200603%2520res; Package: 0603
R41 = Res 0603 220K: 100mW Thick Film Resistors 75V ±100ppm/℃ ±1% 220kΩ 0603 Chip Resistor - Surface Mount ROHS; ComponentLink1Description: LCSC ref link; ComponentLink1URL: https://www.lcsc.com/product-detail/Chip-Resistor-Surface-Mount_YAGEO-RC0603FR-07220KL_C123420.html?s_z=n_220k%25200603%2520res; Package: 0603
R42 R43 R48 = Res 0603 10K: as R1 on sheet IB_V2_MCU; ComponentLink1Description: LCSC ref link; ComponentLink1URL: https://www.lcsc.com/product-detail/Chip-Resistor-Surface-Mount_UNI-ROYAL-Uniroyal-Elec-0603WAF1002T5E_C25804.html?s_z=s_Resistors%257CChip%2520Resistor%2520-%2520Surface%2520Mount; Package: 0603
R44 R47 = Res 0603 1K: 0.1W Thick Film Resistors 75V ±100ppm/℃ ±1% 1kΩ 0603 Chip Resistor - Surface Mount ROHS; ComponentLink1Description: LCSC ref link; ComponentLink1URL: https://www.lcsc.com/product-detail/Chip-Resistor-Surface-Mount_UNI-ROYAL-Uniroyal-Elec-0603WAF1001T5E_C21190.html?s_z=s_Resistors%257CChip%2520Resistor%2520-%2520Surface%2520Mount; Package: 0603
R45 R51 = Res 0603 100K: 100mW Thick Film Resistors 75V ±100ppm/℃ ±1% 100kΩ 0603 Chip Resistor - Surface Mount ROHS; ComponentLink1Description: LCSC ref link; ComponentLink1URL: https://www.lcsc.com/product-detail/Chip-Resistor-Surface-Mount_YAGEO-RC0603FR-07100KL_C14675.html?s_z=n_100k%25200603%2520res; Package: 0603
R49 = Res 0603 15K: 100mW Thick Film Resistors 75V ±100ppm/℃ ±1% 15kΩ 0603 Chip Resistor - Surface Mount ROHS; ComponentLink1Description: LCSC ref link; ComponentLink1URL: https://www.lcsc.com/product-detail/Chip-Resistor-Surface-Mount_YAGEO-RC0603FR-0715KL_C114661.html?s_z=n_15k%25200603%2520res; Package: 0603
R50 = Res 0603 150K: 100mW Thick Film Resistors 75V ±100ppm/℃ ±1% 150kΩ 0603 Chip Resistor - Surface Mount ROHS; ComponentLink1Description: LCSC ref link; ComponentLink1URL: https://www.lcsc.com/product-detail/Chip-Resistor-Surface-Mount_YAGEO-RC0603FR-07150KL_C114660.html?s_z=n_150k%25200603%2520res; Package: 0603
R52 = Res 0603 3K3: 100mW Thick Film Resistors 75V ±100ppm/℃ ±1% 3.3kΩ 0603 Chip Resistor - Surface Mount ROHS; ComponentLink1Description: LCSC ref link; ComponentLink1URL: https://www.lcsc.com/product-detail/Chip-Resistor-Surface-Mount_YAGEO-RC0603FR-073K3L_C108078.html?s_z=n_3k3%25200603%2520res; Package: 0603
T14 T15 = Transistor - 2N2222
U2 = 7805
U3 = TPS54360DDAR: Step-down type 800mV~58.8V 3.5A 4.5V~60V SOIC-8-EP DC-DC Converters ROHS; ComponentLink1Description: LCSC ref link; ComponentLink1URL: https://www.lcsc.com/product-detail/DC-DC-Converters_Texas-Instruments-TPS54360DDAR_C44377.html?s_z=n_tps54360; Package: SOIC-8-EP

## Nets that join several sheets
+3V3: IB_V2_MCU (21 pins), IB_V2_POWER (AMS1.2 AMS1.4 C17.1 C18.1)
+5V: IB_V2_AUDIO (6 pins), IB_V2_MCU (R11.1 T1.2), IB_V2_POWER (AMS1.3 C15.1 C16.1 F1.2)
+12V: IB_V2_MOSFET (8 pins), IB_V2_POWER (7 pins)
BAT+: IB_V2_MOSFET (6 pins), IB_V2_POWER (5 pins)
GND: IB_V2_AUDIO (7 pins), IB_V2_MCU (R13.2), IB_V2_MOSFET (24 pins), IB_V2_POWER (31 pins)
NetC12_2: IB_V2_MCU (U1.16), IB_V2_POWER (C12.2 R38.1 R39.2)
NetD1_2: IB_V2_MCU (U1.15), IB_V2_POWER (D1.2 R42.2 R43.1 R44.2)
NetH6_2: IB_V2_AUDIO (H6.2), IB_V2_MCU (U1.28)
NetJQB1_1: IB_V2_AUDIO (JQB1.1), IB_V2_MCU (U1.41)
NetJQB1_2: IB_V2_AUDIO (JQB1.2), IB_V2_MCU (U1.42)
NetJQB1_4: IB_V2_AUDIO (JQB1.4), IB_V2_MCU (U1.43)
NetJQB1_5: IB_V2_AUDIO (JQB1.5), IB_V2_MCU (U1.45)
NetJQB1_7: IB_V2_AUDIO (JQB1.7), IB_V2_MCU (U1.46)
NetJQB1_8: IB_V2_AUDIO (JQB1.8), IB_V2_MCU (U1.21)
NetJQB1_10: IB_V2_AUDIO (JQB1.10), IB_V2_MCU (U1.22)
NetJQB1_11: IB_V2_AUDIO (JQB1.11), IB_V2_MCU (U1.25)
NetJQB1_13: IB_V2_AUDIO (JQB1.13), IB_V2_MCU (U1.26)
NetJQB1_14: IB_V2_AUDIO (JQB1.14), IB_V2_MCU (U1.27)
NetR20_2: IB_V2_MCU (U1.18), IB_V2_MOSFET (R20.2)
NetR25_2: IB_V2_MCU (U1.19), IB_V2_MOSFET (R25.2)
NetR30_2: IB_V2_MCU (U1.39), IB_V2_MOSFET (R30.2)
NetR35_2: IB_V2_MCU (U1.40), IB_V2_MOSFET (R35.2)
NetR47_2: IB_V2_MCU (U1.13), IB_V2_POWER (R47.2)
NetR48_1: IB_V2_MCU (U1.14), IB_V2_POWER (R48.1)